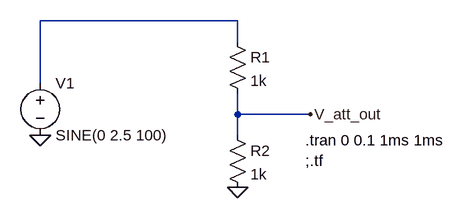
[diagram p0: schematic Vin_2_5_Vpp_Vout_halfVin.asc]
Vin_2_5_Vpp_Vout_halfVin.asc, the LTspice schematic file:
Version 4.1
SHEET 1 880 680
WIRE 256 16 -48 16
WIRE 256 48 256 16
WIRE -48 112 -48 16
WIRE 256 160 256 128
WIRE 368 160 256 160
WIRE 256 192 256 160
FLAG -48 192 0
FLAG 256 272 0
FLAG 368 160 V_att_out
SYMBOL voltage -48 96 R0
WINDOW 123 0 0 Left 0
WINDOW 39 0 0 Left 0
SYMATTR InstName V1
SYMATTR Value SINE(0 2.5 100)
SYMBOL res 240 32 R0
SYMATTR InstName R1
SYMATTR Value 1k
SYMBOL res 240 176 R0
SYMATTR InstName R2
SYMATTR Value 1k
TEXT 360 200 Left 2 !.tran 0 0.1 1ms 1ms\n;.tf

The netlist it stands for:
* Vin_2_5_Vpp_Vout_halfVin.asc
V1 N001 0 SINE(0 2.5 100)
R1 N001 V_att_out 1k
R2 V_att_out 0 1k
.tran 0 0.1 1ms 1ms
;.tf
.backanno
.end